# EAGLE design deca_pcb (EAGLE 9.3.0)
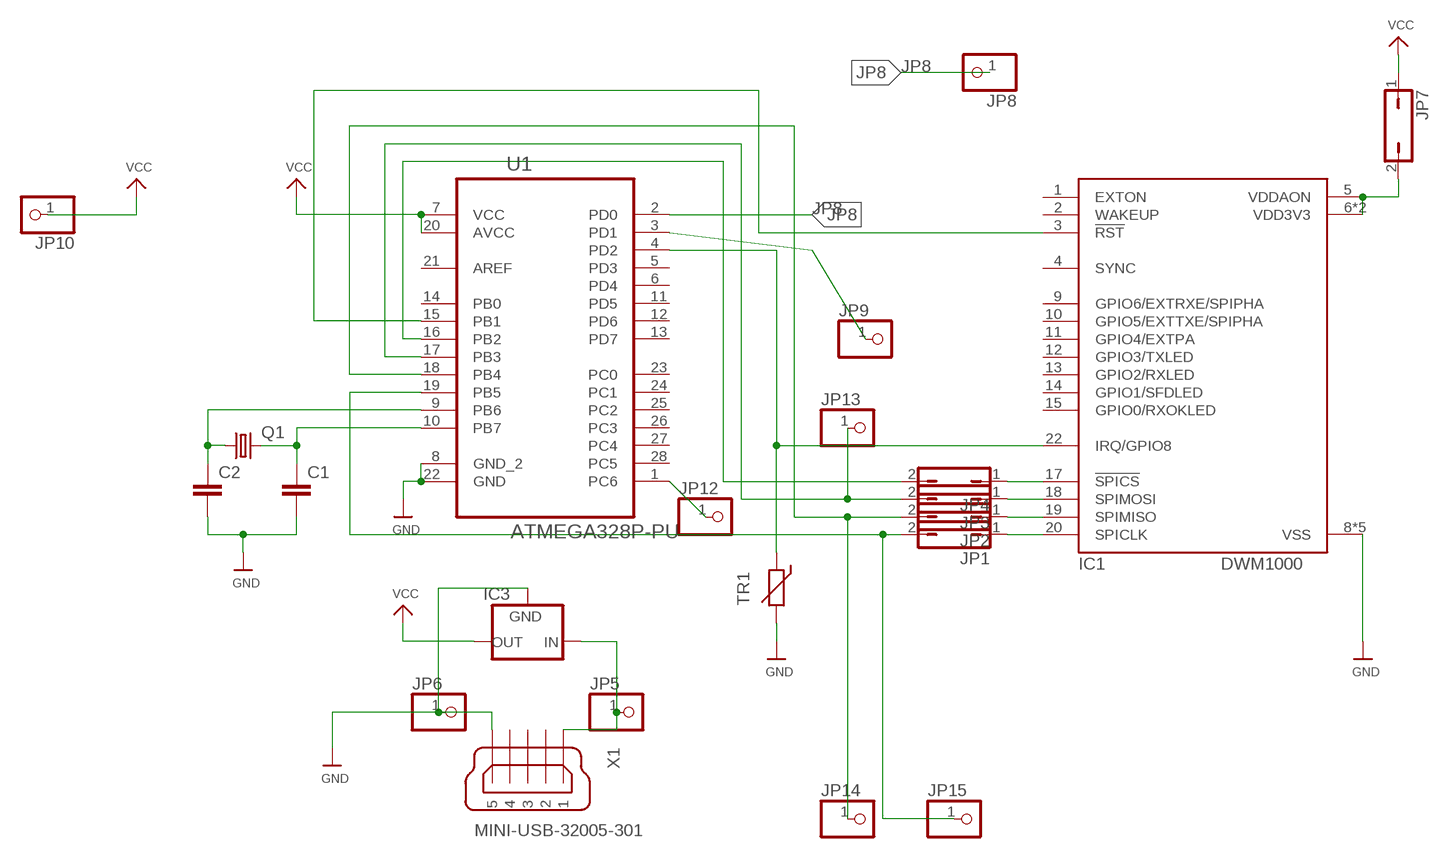
[diagram p0: schematic, sheet 1]

## Parts
C1  C2.5/6  [C2.5-6]
C2  C2.5/6  [C2.5-6]
IC1  DWM1000  [DWM1000]
IC3  LFXXCVS  [TO220S]
JP1  JP1Q  [JP1]
JP2  JP1Q  [JP1]
JP3  JP1Q  [JP1]
JP4  JP1Q  [JP1]
JP5  PINHD-1X1_2.54  [1X01]
JP6  PINHD-1X1_2.54  [1X01]
JP7  JP1Q  [JP1]
JP8  PINHD-1X1_2.54  [1X01]
JP9  PINHD-1X1_2.54  [1X01]
JP10  PINHD-1X1_2.54  [1X01]
JP12  PINHD-1X1_2.54  [1X01]
JP13  PINHD-1X1_2.54  [1X01]
JP14  PINHD-1X1_2.54  [1X01]
JP15  PINHD-1X1_2.54  [1X01]
Q1  CRYSTALHC49S  [HC49/S]
TR1  THERMISTOR_R-5  [R-5]
U1  ATMEGA328P-PU  [DIP254P762X457-28]
X1  MINI-USB-32005-301  [32005-301]

## Nets
GND: C1.2 C2.2 IC1.8(VSS) IC1.16(VSS) IC1.21(VSS) IC1.23(VSS) IC1.24(VSS) IC3.2(GND) JP6.1 TR1.2 U1.8(GND_2) U1.22(GND) X1.5
JP8: JP8.1 U1.2(PD0)
N$1: JP1.2 JP15.1 U1.19(PB5)
N$2: JP2.2 JP14.1 U1.18(PB4)
N$3: JP3.2 JP13.1 U1.17(PB3)
N$4: JP4.2 U1.16(PB2)
N$5: IC1.22(IRQ/GPIO8) TR1.1 U1.4(PD2)
N$6: IC1.3(!RST) U1.15(PB1)
N$7: C2.1 Q1.1 U1.9(PB6)
N$8: C1.1 Q1.2 U1.10(PB7)
N$9: IC1.5(VDDAON) IC1.6(VDD3V3) IC1.7(VDD3V3) JP7.2
N$10: IC3.1(IN) JP5.1 X1.1
N$11: IC1.20(SPICLK) JP1.1
N$14: IC1.19(SPIMISO) JP2.1
N$15: IC1.18(SPIMOSI) JP3.1
N$16: IC1.17(!SPICS) JP4.1
N$18: JP9.1 U1.3(PD1)
N$19: JP12.1 U1.1(PC6)
VCC: IC3.3(OUT) JP7.1 JP10.1 U1.7(VCC) U1.20(AVCC)
Unconnected: IC1.1(EXTON) IC1.2(WAKEUP) IC1.4(SYNC) IC1.9(GPIO6/EXTRXE/SPIPHA) IC1.10(GPIO5/EXTTXE/SPIPHA) IC1.11(GPIO4/EXTPA) IC1.12(GPIO3/TXLED) IC1.13(GPIO2/RXLED) IC1.14(GPIO1/SFDLED) IC1.15(GPIO0/RXOKLED) U1.5(PD3) U1.6(PD4) U1.11(PD5) U1.12(PD6) U1.13(PD7) U1.14(PB0) U1.21(AREF) U1.23(PC0) U1.24(PC1) U1.25(PC2) U1.26(PC3) U1.27(PC4) U1.28(PC5) X1.2 X1.3 X1.4

## Library data of the parts
C1 C2 = capacitor-wima:C: CAPACITOR naming: grid - package width
IC1 = decawave:DWM1000
IC3 = lf33:LFXXCV: VOLTAGE REGULATOR
JP1-JP4 JP7 = jumper:JP1Q: JUMPER
JP5 JP6 JP8-JP10 JP12-JP15 = con-pinhead:PINHD-1X1: PIN HEADER
Q1 = crystal:CRYSTAL: CRYSTAL; OC_FARNELL: 1667008; OC_NEWARK: unknown
TR1 = discrete:THERMISTOR_: Thermo Resistor
U1 = atmel-element14:ATMEGA328P-PU: 8-bit Microcontroller with In-System Programmable Flash; MPN: ATMEGA328P-PU; OC_FARNELL: 1715487; OC_NEWARK: 15R0268; PACKAGE: PDIP-28; SUPPLIER: Atmel
X1 = con-cypressindustries:MINI-USB-: MINI USB-B Conector Source: www.cypressindustries.com; OC_FARNELL: unknown; OC_NEWARK: unknown

## Board
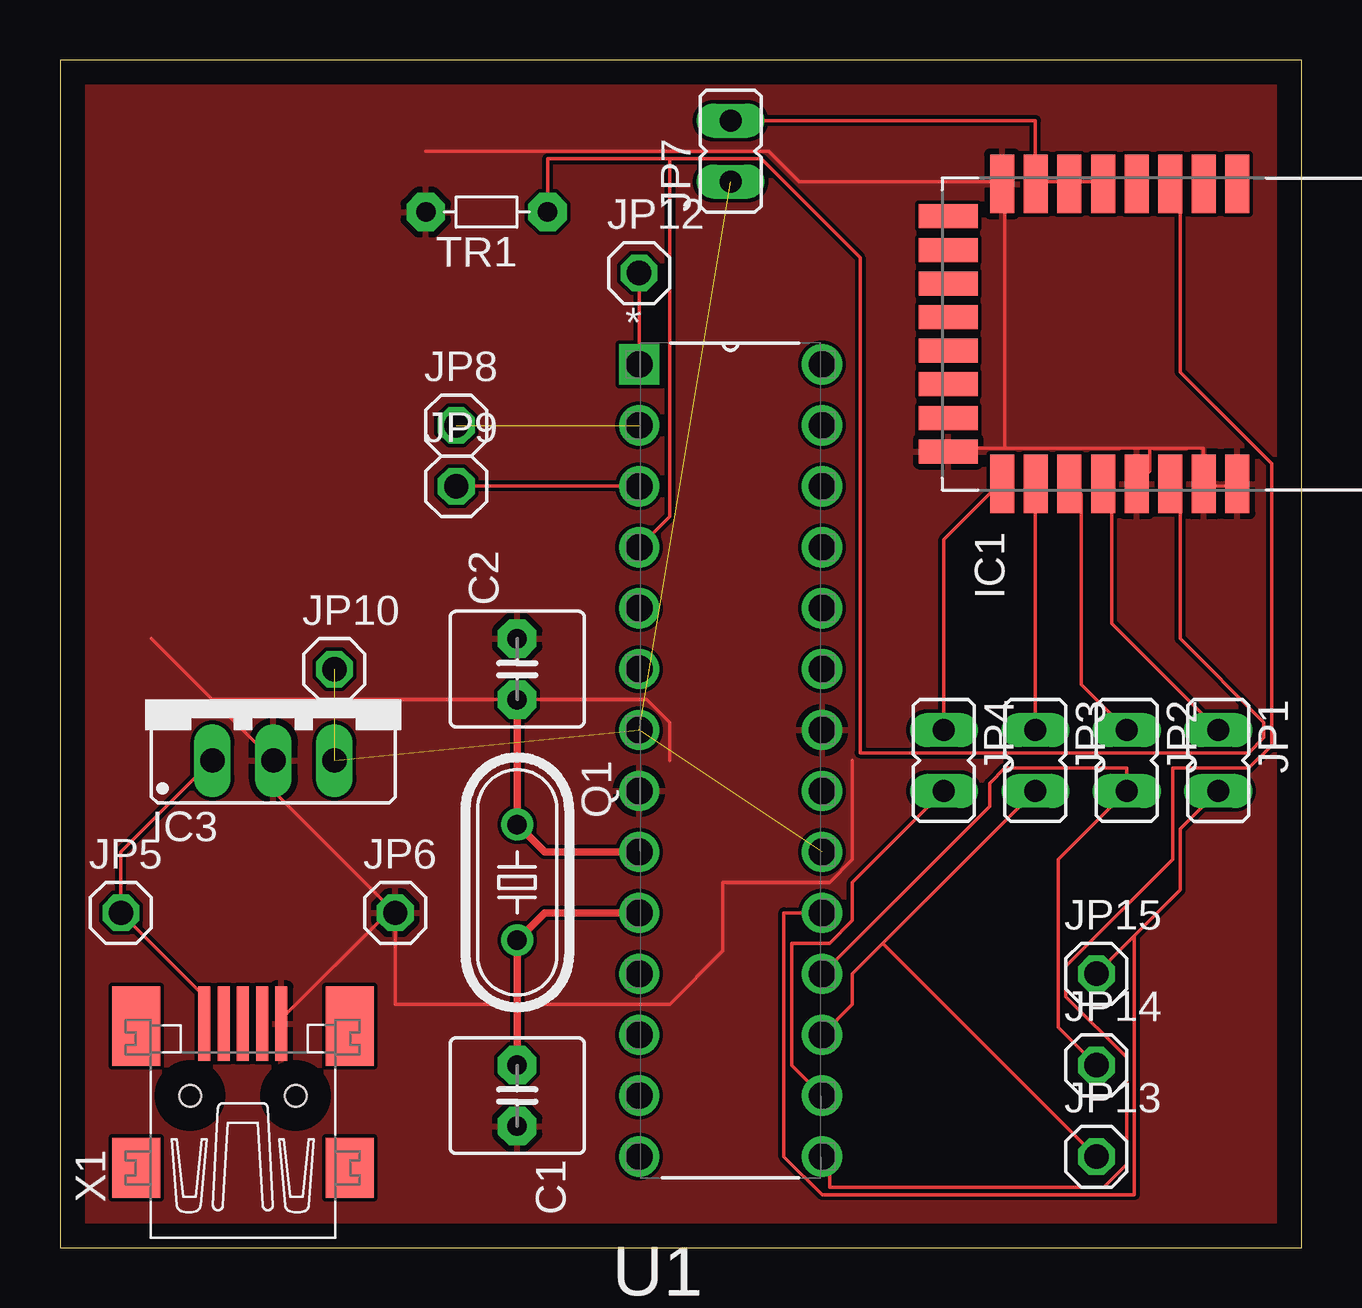
[diagram p1: board, top side]

Size 51.74 x 49.52 mm. Coordinates in mm from the lower left corner, seen from the top.
Outline: 0,0 51.74,0 51.74,49.52 0,49.52 0,0
Copper layers (1*16): Top 0.035mm / dielectric 1.5mm / Bottom 0.035mm
Design rules "default": minimum track width 6mil, minimum drill 0.35mm, track to track 6mil, track to pad 6mil, pad to pad 6mil, via to via 6mil, smd to smd 6mil, copper to edge 40mil, drill to drill 6mil, minimum pad ring 10mil, minimum via ring 8mil, stop-mask expansion 4mil, vias tented up to drill 0mil, thermal gap 10mil

### Footprints (pad centres in the part's own frame; a part is rotated, then mirrored left to right if it is on the bottom)
C2.5-6 = drill 0.813 pad 1.6 octagon: 1 -1.27,0; 2 1.27,0
DWM1000 = smd 2.45 x 1: 1 -6.25,0.8; 2 -6.25,-0.6; 3 -6.25,-2; 4 -6.25,-3.4; 5 -6.25,-4.8; 6 -6.25,-6.2; 7 -6.25,-7.6; 8 -6.25,-9; 17 6.25,-9; 18 6.25,-7.6; 19 6.25,-6.2; 20 6.25,-4.8; 21 6.25,-3.4; 22 6.25,-2; 23 6.25,-0.6; 24 6.25,0.8 | smd 1 x 2.45: 9 -4.9,-11.25; 10 -3.5,-11.25; 11 -2.1,-11.25; 12 -0.7,-11.25; 13 0.7,-11.25; 14 2.1,-11.25; 15 3.5,-11.25; 16 4.9,-11.25
TO220S = drill 1.016 long: 1 -2.54,-2.54; 2 0,-2.54; 3 2.54,-2.54
JP1 = drill 0.914 long: 1 0,-1.27; 2 0,1.27
1X01 = drill 1.016 octagon: 1 0,0
HC49/S = drill 0.813: 1 -2.413,0; 2 2.413,0
R-5 = drill 0.813 pad 1.6 octagon: 1 -2.54,0; 2 2.54,0
DIP254P762X457-28 = drill 1.118 square: 1 -7.62,33.02 | drill 1.118: 2 -7.62,30.48; 3 -7.62,27.94; 4 -7.62,25.4; 5 -7.62,22.86; 6 -7.62,20.32; 7 -7.62,17.78; 8 -7.62,15.24; 9 -7.62,12.7; 10 -7.62,10.16; 11 -7.62,7.62; 12 -7.62,5.08; 13 -7.62,2.54; 14 -7.62,0; 15 0,0; 16 0,2.54; 17 0,5.08; 18 0,7.62; 19 0,10.16; 20 0,12.7; 21 0,15.24; 22 0,17.78; 23 0,20.32; 24 0,22.86; 25 0,25.4; 26 0,27.94; 27 0,30.48; 28 0,33.02
32005-301 = smd 3.1 x 0.5: 1 3,1.6; 2 3,0.8; 3 3,0; 4 3,-0.8; 5 3,-1.6 | smd 2.5 x 2: M1 -3,-4.45; M2 -3,4.45 | smd 3.3 x 2: M3 2.9,4.45; M4 2.9,-4.45 | hole 0.9: 0,2.2; 0,-2.2

### Placement (x,y rotation side)
C1  19.05,6.35 270 top
C2  19.05,24.13 90 top
IC1  48.26,38.1 270 top
IC3  8.89,22.86 0 top
JP1  48.26,20.32 180 top
JP2  44.45,20.32 180 top
JP3  40.64,20.32 180 top
JP4  36.83,20.32 180 top
JP5  2.54,13.97 0 top
JP6  13.97,13.97 0 top
JP7  27.94,45.72 0 top
JP8  16.51,34.29 0 top
JP9  16.51,31.75 0 top
JP10  11.43,24.13 0 top
JP12  24.13,40.64 0 top
JP13  43.18,3.81 0 top
JP14  43.18,7.62 0 top
JP15  43.18,11.43 0 top
Q1  19.05,15.24 270 top
TR1  17.78,43.18 180 top
U1  31.75,3.81 0 top
X1  7.62,6.35 90 top

### Tracks (layer width: path | path; a pad name or v marks a point on that pad's centre or on a via)
GND
  Top 0.152: 3.81,25.4 6.35,22.86 | 6.35,22.86 IC3.2 8.89,19.05 13.65,14.29 | 13.65,14.29 13.65,13.97 9.21,9.53 X1.5 | 13.65,14.29 JP6.1 13.97,10.16 25.4,10.16 27.62,12.38 27.62,15.24 32.07,15.24 33.02,16.19 33.02,20.32 | 25.4,20.32 25.4,21.91 24.45,22.86 6.35,22.86 | 45.4,33.34 45.4,32.38 45.09,32.07 IC1.21 | 45.4,33.34 47.62,33.34 47.62,32.07 IC1.23 47.94,31.75 48.9,31.75 IC1.24 | 45.4,33.34 39.37,33.34 | 39.37,33.34 37.15,33.34 IC1.16 | 39.37,33.34 39.37,44.13 IC1.8 39.05,44.45 30.8,44.45 29.53,45.72 15.24,45.72
  pour Top: 0,49.53 52.07,49.53 52.07,0 0,0
JP8  (1 unrouted)
N$1
  Top 0.152: JP1.2 46.67,17.46 46.67,14.92 44.77,13.02 | JP15.1 44.77,13.02 | U1.19 30.16,13.97 30.16,3.81 31.75,2.22 44.77,2.22 44.77,13.02
N$2
  Top 0.152: JP14.1 41.59,9.21 41.59,16.19 JP2.2 44.45,20 39.37,20 38.73,19.37 38.73,18.41 U1.18
N$3
  Top 0.152: 34.29,12.7 33.02,11.43 33.02,10.16 U1.17 | 34.29,12.7 JP3.2 | 34.29,12.7 JP13.1
N$4
  Top 0.152: JP4.2 33.02,15.24 33.02,13.65 32.07,12.7 30.48,12.7 30.48,7.62 U1.16
N$5
  Top 0.152: 25.4,45.4 20.32,45.4 TR1.1 | 25.4,45.4 29.21,45.4 33.34,41.27 33.34,20.64 49.53,20.64 50.16,21.27 50.16,21.91 46.67,25.4 46.67,31.43 46.35,31.75 IC1.22 | U1.4 25.4,30.48 25.4,45.4
N$6
  Top 0.152: U1.15 32.07,3.49 32.07,2.54 43.5,2.54 44.45,3.49 44.45,7.94 41.91,10.48 41.91,11.75 46.35,16.19 46.35,20 49.53,20 50.48,20.95 50.48,32.7 46.67,36.51 46.67,43.81 46.35,44.13 IC1.3
N$7
  Top 0.305: U1.9 20.19,16.51 Q1.1 C2.1
N$8
  Top 0.305: U1.10 20.19,13.97 Q1.2 C1.1
N$9
  Top 0.152: IC1.5 43.18,44.45 42.23,44.45 IC1.6 41.91,44.45 40.96,44.45 IC1.7 40.64,44.45 40.64,46.99 JP7.2
N$10
  Top 0.152: X1.1 6.03,9.53 6.03,10.48 JP5.1 2.54,16.51 IC3.1
N$11
  Top 0.152: JP1.1 43.81,26.04 43.81,31.43 43.5,31.75 IC1.20
N$14
  Top 0.152: JP2.1 42.55,23.5 42.55,31.43 42.23,31.75 IC1.19
N$15
  Top 0.152: JP3.1 40.64,31.75 IC1.18
N$16
  Top 0.152: JP4.1 36.83,29.53 39.05,31.75 IC1.17
N$18
  Top 0.152: U1.3 JP9.1
N$19
  Top 0.152: U1.1 JP12.1
VCC  (4 unrouted)